# EAGLE schematic frankenbadge (EAGLE 9.4.1)

## Sheet 1 of 2: Main Sheet including: - PSU - RTC - MCU - Nixie tubes - Nixie driver - Nixie multiplexing
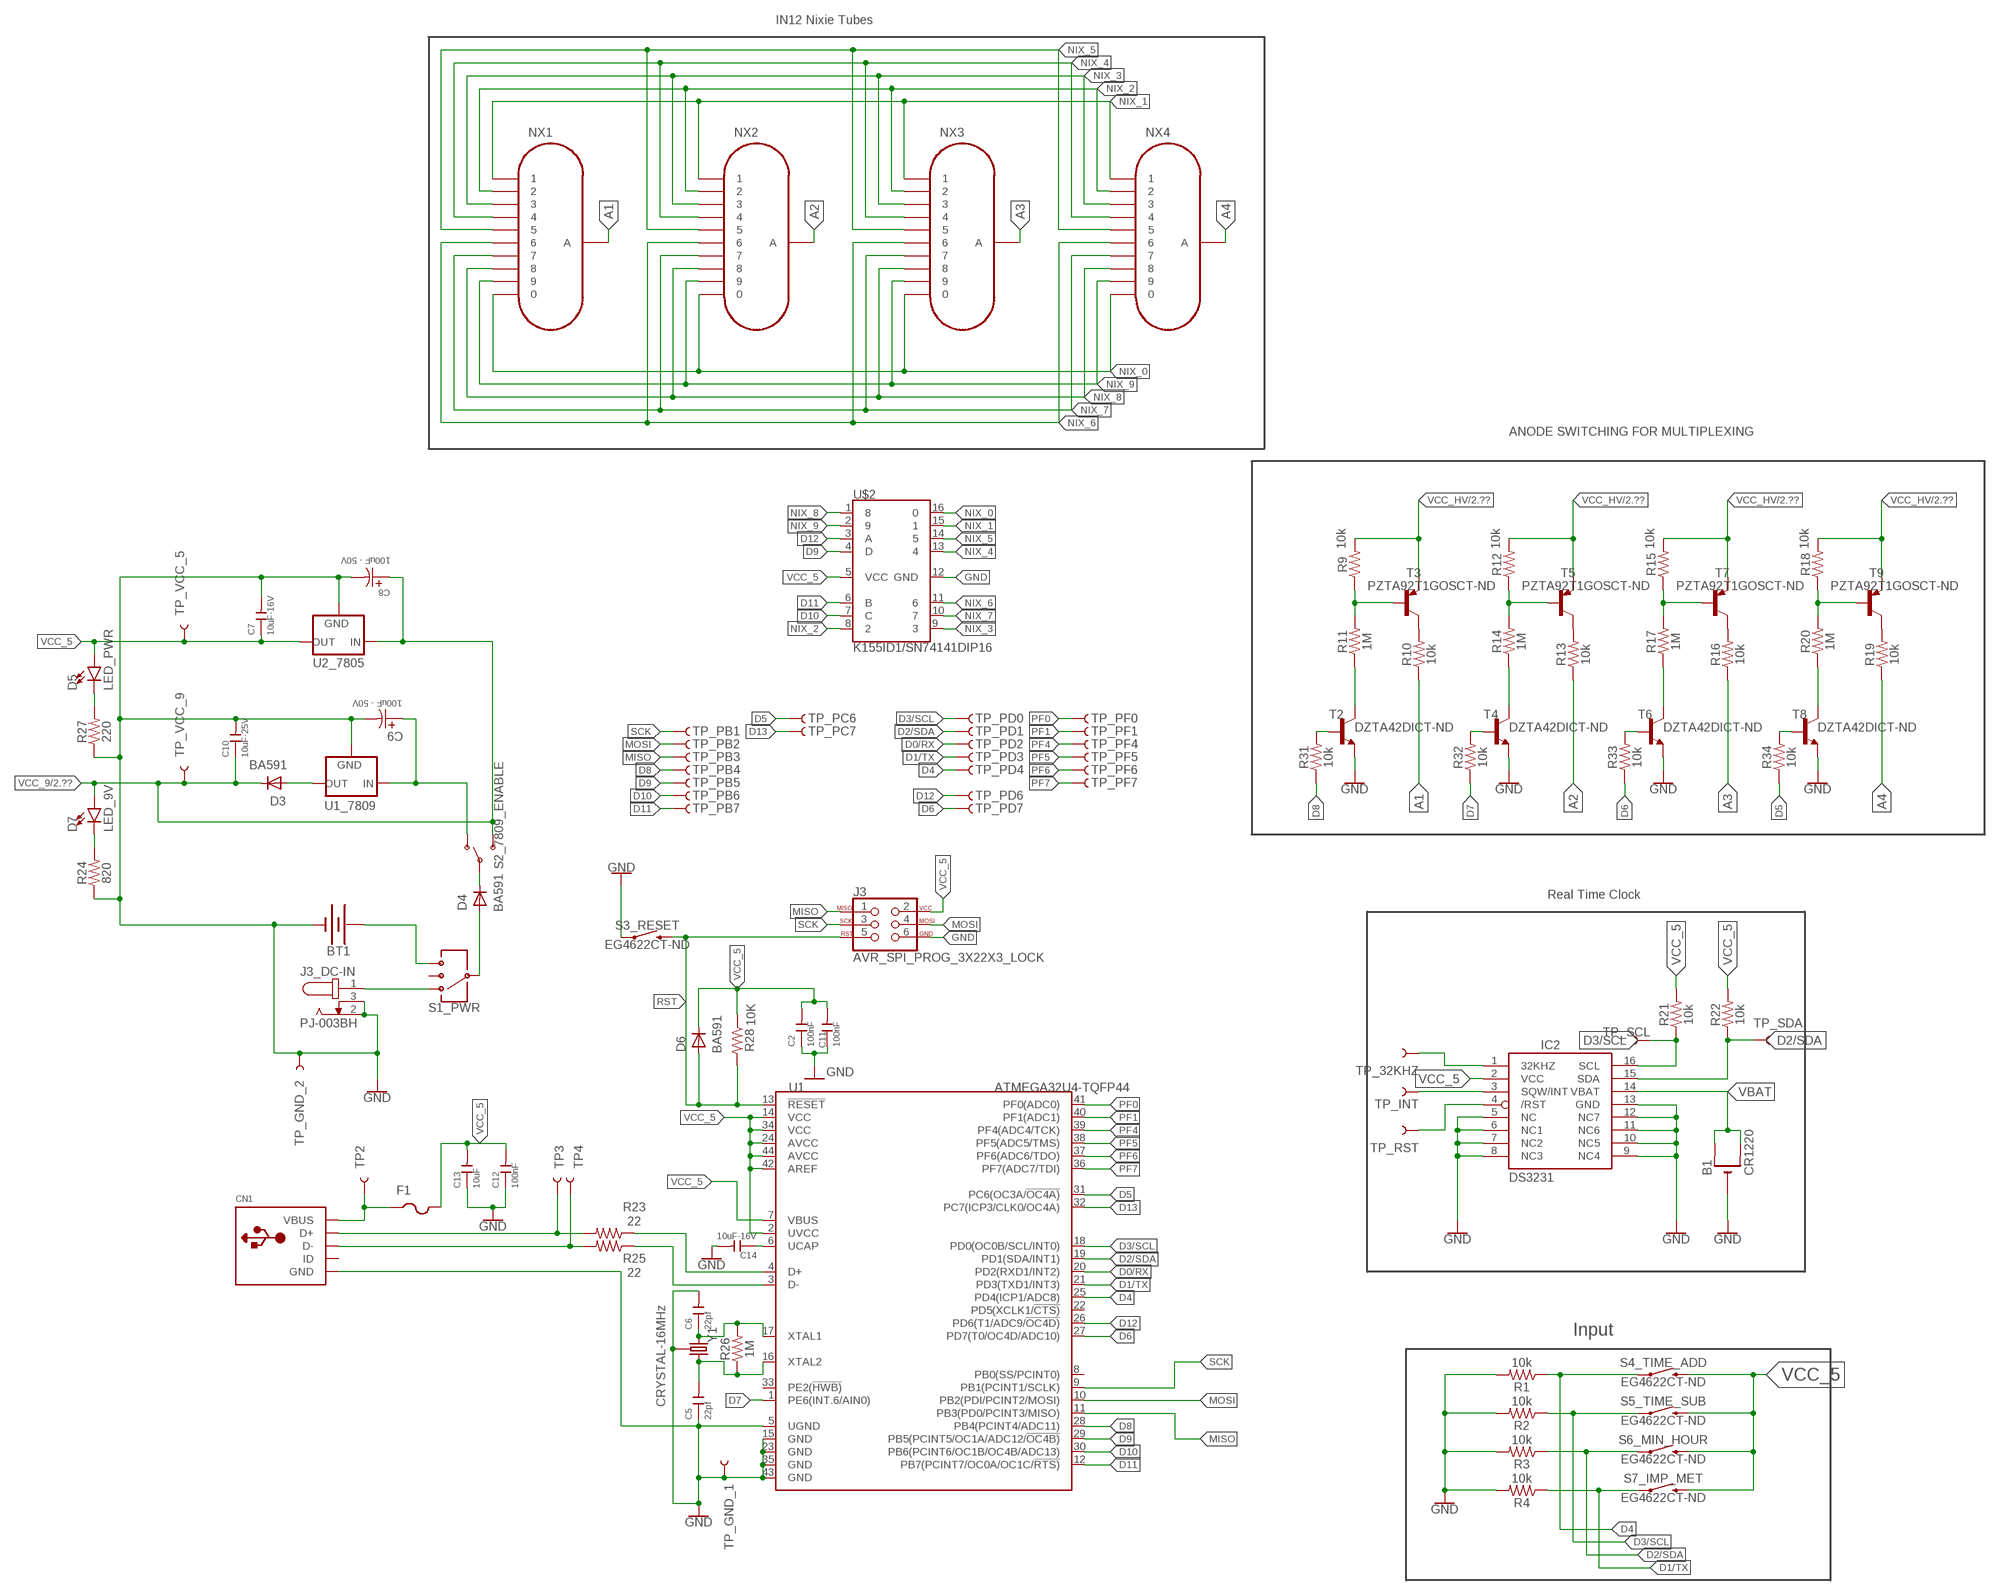
[diagram p0: schematic, sheet 1]

### Parts
B1  CR1220  CR1220SMT  [CR1220-SMD]
BT1  BATTERY-9V  [BATTCON_9V]
C2  100nF  CERAMIC-1UF-25V-10%-X7R(0805)  [C0805]
C5  22pf  CERAMIC-22PF-50V-5%-NPO(0402)  [C0402]
C6  22pf  CERAMIC-22PF-50V-5%-NPO(0402)  [C0402]
C7  10uF-16V  CERAMIC-1UF-25V-10%-X7R(0805)  [C0805]
C8  100uF - 50V  UWT1H101MNL1GSPCAP_8X10-ELECT-M  [PCAP_8X10-ELECT-M]
C9  100uF - 50V  UWT1H101MNL1GSPCAP_8X10-ELECT-M  [PCAP_8X10-ELECT-M]
C10  10uF-25V  CERAMIC-10UF-25V-10%-X5R(1206)  [C1206]
C11  100nF  CERAMIC-1UF-25V-10%-X7R(0805)  [C0805]
C12  100nF  CERAMIC-22PF-50V-5%-NPO(0402)  [C0402]
C13  10uF  CERAMIC-22PF-50V-5%-NPO(0402)  [C0402]
C14  10uF-16V  CERAMIC-1UF-25V-10%-X7R(0805)  [C0805]
CN1  USBMINIB  [USB-MINIB]
D3  BA591  [SOD323(F)]
D4  BA591  [SOD323(F)]
D5  LED_PWR  LED-BLUE0603  [LED-0603]
D6  BA591  [SOD323(F)]
D7  LED_9V  LED-GREEN0603  [LED-0603]
F1  PTCFUSE-1812  [1812]
IC2  DS3231/SO  [SO16W]
J3  AVR_SPI_PROG_3X22X3_LOCK  [2X3_LOCK]
J3_DC-IN  PJ-003BH  [CUI_PJ-003BH]
NX1  IN-12A  [IN-12]
NX2  IN-12A  [IN-12]
NX3  IN-12A  [IN-12]
NX4  IN-12A  [IN-12]
R1  10k  10KOHM-0603-1/10W-1%  [0603]
R2  10k  10KOHM-0603-1/10W-1%  [0603]
R3  10k  10KOHM-0603-1/10W-1%  [0603]
R4  10k  10KOHM-0603-1/10W-1%  [0603]
R9  10k  10KOHM-0603-1/10W-1%  [0603]
R10  10k  10KOHM-0603-1/10W-1%  [0603]
R11  1M  1MOHM-0603-1/4W-5%  [0603]
R12  10k  10KOHM-0603-1/10W-1%  [0603]
R13  10k  10KOHM-0603-1/10W-1%  [0603]
R14  1M  1MOHM-0603-1/4W-5%  [0603]
R15  10k  10KOHM-0603-1/10W-1%  [0603]
R16  10k  10KOHM-0603-1/10W-1%  [0603]
R17  1M  1MOHM-0603-1/4W-5%  [0603]
R18  10k  10KOHM-0603-1/10W-1%  [0603]
R19  10k  10KOHM-0603-1/10W-1%  [0603]
R20  1M  1MOHM-0603-1/4W-5%  [0603]
R21  10k  10KOHM-0603-1/10W-1%  [0603]
R22  10k  10KOHM-0603-1/10W-1%  [0603]
R23  22  220OHM-0603-1/10W-1%  [0603]
R24  820  220OHM-0603-1/10W-1%  [0603]
R25  22  220OHM-0603-1/10W-1%  [0603]
R26  1M  220OHM-0603-1/10W-1%  [0603]
R27  220  220OHM-0603-1/10W-1%  [0603]
R28  10K  220OHM-0603-1/10W-1%  [0603]
R31  10k  10KOHM-0603-1/10W-1%  [0603]
R32  10k  10KOHM-0603-1/10W-1%  [0603]
R33  10k  10KOHM-0603-1/10W-1%  [0603]
R34  10k  10KOHM-0603-1/10W-1%  [0603]
S1_PWR  SWITCH-SP3T-SMD  [SWITCH_SP3T_SMD]
S2_7809_ENABLE  SWITCH-SPDT-SMD-RIGHT-ANGLE  [SWITCH_SPST_SMD_A]
S3_RESET  EG4622CT-ND  MOMENTARY-SWITCH-SPST-SMD-4.5MM  [TACTILE_SWITCH_SMD_4.5MM]
S4_TIME_ADD  EG4622CT-ND  MOMENTARY-SWITCH-SPST-SMD-4.5MM  [TACTILE_SWITCH_SMD_4.5MM]
S5_TIME_SUB  EG4622CT-ND  MOMENTARY-SWITCH-SPST-SMD-4.5MM  [TACTILE_SWITCH_SMD_4.5MM]
S6_MIN_HOUR  EG4622CT-ND  MOMENTARY-SWITCH-SPST-SMD-4.5MM  [TACTILE_SWITCH_SMD_4.5MM]
S7_IMP_MET  EG4622CT-ND  MOMENTARY-SWITCH-SPST-SMD-4.5MM  [TACTILE_SWITCH_SMD_4.5MM]
T2  DZTA42DICT-ND  PBSS4360Z  [SOT223]
T3  PZTA92T1GOSCT-ND  PBSS5360Z  [SOT223]
T4  DZTA42DICT-ND  PBSS4360Z  [SOT223]
T5  PZTA92T1GOSCT-ND  PBSS5360Z  [SOT223]
T6  DZTA42DICT-ND  PBSS4360Z  [SOT223]
T7  PZTA92T1GOSCT-ND  PBSS5360Z  [SOT223]
T8  DZTA42DICT-ND  PBSS4360Z  [SOT223]
T9  PZTA92T1GOSCT-ND  PBSS5360Z  [SOT223]
TP2  TEST-POINT3  [PAD.03X.03]
TP3  TEST-POINT3  [PAD.03X.03]
TP4  TEST-POINT3  [PAD.03X.03]
TP_32KHZ  TEST-POINT3  [PAD.03X.03]
TP_GND_1  TEST-POINT3  [PAD.03X.03]
TP_GND_2  TEST-POINT3  [PAD.03X.03]
TP_INT  TEST-POINT3  [PAD.03X.03]
TP_PB1  TEST-POINT3  [PAD.03X.03]
TP_PB2  TEST-POINT3  [PAD.03X.03]
TP_PB3  TEST-POINT3  [PAD.03X.03]
TP_PB4  TEST-POINT3  [PAD.03X.03]
TP_PB5  TEST-POINT3  [PAD.03X.03]
TP_PB6  TEST-POINT3  [PAD.03X.03]
TP_PB7  TEST-POINT3  [PAD.03X.03]
TP_PC6  TEST-POINT3  [PAD.03X.03]
TP_PC7  TEST-POINT3  [PAD.03X.03]
TP_PD0  TEST-POINT3  [PAD.03X.03]
TP_PD1  TEST-POINT3  [PAD.03X.03]
TP_PD2  TEST-POINT3  [PAD.03X.03]
TP_PD3  TEST-POINT3  [PAD.03X.03]
TP_PD4  TEST-POINT3  [PAD.03X.03]
TP_PD6  TEST-POINT3  [PAD.03X.03]
TP_PD7  TEST-POINT3  [PAD.03X.03]
TP_PF0  TEST-POINT3  [PAD.03X.03]
TP_PF1  TEST-POINT3  [PAD.03X.03]
TP_PF4  TEST-POINT3  [PAD.03X.03]
TP_PF5  TEST-POINT3  [PAD.03X.03]
TP_PF6  TEST-POINT3  [PAD.03X.03]
TP_PF7  TEST-POINT3  [PAD.03X.03]
TP_RST  TEST-POINT3  [PAD.03X.03]
TP_SCL  TEST-POINT3  [PAD.03X.03]
TP_SDA  TEST-POINT3  [PAD.03X.03]
TP_VCC_5  TEST-POINT3  [PAD.03X.03]
TP_VCC_9  TEST-POINT3  [PAD.03X.03]
U1  ATMEGA32U4-TQFP44  MCU-ATMEGA32U4-AU(TQFP44)  [TQFP44-0.8-9.6X9.6MM]
U1_7809  +12v  V_REG_78XX7812  [TO-252]
U2_7805  +12v  V_REG_78XX7812  [TO-252]
U$2  K155ID1/SN74141DIP16  [DIP762W53P254L1969H508Q16B]
Y1  CRYSTAL-16MHz  CRYSTAL-26MHZSMD-3.2X2.5  [CRYSTAL-SMD-3.2X2.5MM]

### Nets
32KHZ: IC2.1(32KHZ) TP_32KHZ.P$1
A1: NX1.A R10.1
A2: NX2.A R13.1
A3: NX3.A R16.1
A4: NX4.A R19.1
D0/RX: TP_PD2.P$1 U1.20(PD2(RXD1/INT2))
D1/TX: R4.1 S7_IMP_MET.2 S7_IMP_MET.3 TP_PD3.P$1 U1.21(PD3(TXD1/INT3))
D2/SDA: IC2.15(SDA) R3.1 R22.1 S6_MIN_HOUR.2 S6_MIN_HOUR.3 TP_PD1.P$1 TP_SDA.P$1 U1.19(PD1(SDA/INT1))
D3/SCL: IC2.16(SCL) R2.1 R21.1 S5_TIME_SUB.2 S5_TIME_SUB.3 TP_PD0.P$1 TP_SCL.P$1 U1.18(PD0(OC0B/SCL/INT0))
D4: R1.1 S4_TIME_ADD.2 S4_TIME_ADD.3 TP_PD4.P$1 U1.25(PD4(ICP1/ADC8))
D5: R34.1 TP_PC6.P$1 U1.31(PC6(OC3A/!OC4A))
D6: R33.1 TP_PD7.P$1 U1.27(PD7(T0/OC4D/ADC10))
D7: R32.1 U1.1(PE6(INT.6/AIN0))
D8: R31.1 TP_PB4.P$1 U1.28(PB4(PCINT4/ADC11))
D9: TP_PB5.P$1 U1.29(PB5(PCINT5/OC1A/ADC12/!OC4B)) U$2.4(D)
D10: TP_PB6.P$1 U1.30(PB6(PCINT6/OC1B/OC4B/ADC13)) U$2.7(C)
D11: TP_PB7.P$1 U1.12(PB7(PCINT7/OC0A/OC1C/!RTS)) U$2.6(B)
D12: TP_PD6.P$1 U1.26(PD6(T1/ADC9/!OC4D)) U$2.3(A)
D13: TP_PC7.P$1 U1.32(PC7(ICP3/CLK0/OC4A))
DS_RST: IC2.4(/RST) TP_RST.P$1
GND: B1.- BT1.- C2.1 C5.1 C6.2 C7.2 C8.2 C9.2 C10.2 C11.1 C12.1 C13.1 C14.2 CN1.GND IC2.5(NC) IC2.6(NC1) IC2.7(NC2) IC2.8(NC3) IC2.9(NC4) IC2.10(NC5) IC2.11(NC6) IC2.12(NC7) IC2.13(GND) J3.6 J3_DC-IN.2 J3_DC-IN.3 R1.2 R2.2 R3.2 R4.2 R24.1 R27.1 S3_RESET.2 S3_RESET.3 T2.3(E) T4.3(E) T6.3(E) T8.3(E) TP_GND_1.P$1 TP_GND_2.P$1 U1.5(UGND) U1.15(GND) U1.23(GND) U1.35(GND) U1.43(GND) U1_7809.3(GND) U2_7805.3(GND) U$2.12(GND) Y1.2 Y1.4 ; also sheet 2
INT: IC2.3(SQW/INT) TP_INT.P$1
MISO: J3.1 TP_PB3.P$1 U1.11(PB3(PD0/PCINT3/MISO))
MOSI: J3.4 TP_PB2.P$1 U1.10(PB2(PDI/PCINT2/MOSI))
N$1: R31.2 T2.1(B)
N$2: R32.2 T4.1(B)
N$3: R33.2 T6.1(B)
N$4: R34.2 T8.1(B)
N$6: R10.2 T3.2(C) T3.4(C)
N$11: C14.1 U1.6(UCAP)
N$14: R9.1 R11.2 T3.1(B)
N$15: R11.1 T2.2(C)
N$16: R13.2 T5.2(C) T5.4(C)
N$17: R12.1 R14.2 T5.1(B)
N$18: R14.1 T4.2(C)
N$19: R16.2 T7.2(C) T7.4(C)
N$20: R15.1 R17.2 T7.1(B)
N$21: R17.1 T6.2(C)
N$22: R19.2 T9.2(C) T9.4(C)
N$23: R18.1 R20.2 T9.1(B)
N$24: R20.1 T8.2(C)
N$25: BT1.+ S1_PWR.4
N$26: J3_DC-IN.1 S1_PWR.1
N$27: D4.2(A) S1_PWR.3
N$28: D4.1(K) S2_7809_ENABLE.2(P)
N$29: C9.1 S2_7809_ENABLE.1(O) U1_7809.1(IN)
N$30: D5.C R27.2
N$31: D3.2(A) U1_7809.2(OUT)
N$32: D7.C R24.2
N$33: C6.1 R26.2 U1.17(XTAL1) Y1.1
N$36: R23.1 U1.4(D+)
N$37: R25.1 U1.3(D-)
N$40: C5.2 R26.1 U1.16(XTAL2) Y1.3
NIX_0: NX1.0 NX2.0 NX3.0 NX4.0 U$2.16
NIX_1: NX1.1 NX2.1 NX3.1 NX4.1 U$2.15
NIX_2: NX1.2 NX2.2 NX3.2 NX4.2 U$2.8
NIX_3: NX1.3 NX2.3 NX3.3 NX4.3 U$2.9
NIX_4: NX1.4 NX2.4 NX3.4 NX4.4 U$2.13
NIX_5: NX1.5 NX2.5 NX3.5 NX4.5 U$2.14
NIX_6: NX1.6 NX2.6 NX3.6 NX4.6 U$2.11
NIX_7: NX1.7 NX2.7 NX3.7 NX4.7 U$2.10
NIX_8: NX1.8 NX2.8 NX3.8 NX4.8 U$2.1
NIX_9: NX1.9 NX2.9 NX3.9 NX4.9 U$2.2
PF0: TP_PF0.P$1 U1.41(PF0(ADC0))
PF1: TP_PF1.P$1 U1.40(PF1(ADC1))
PF4: TP_PF4.P$1 U1.39(PF4(ADC4/TCK))
PF5: TP_PF5.P$1 U1.38(PF5(ADC5/TMS))
PF6: TP_PF6.P$1 U1.37(PF6(ADC6/TDO))
PF7: TP_PF7.P$1 U1.36(PF7(ADC7/TDI))
RST: D6.2(A) J3.5 R28.2 S3_RESET.1 S3_RESET.4 U1.13(!RESET)
SCK: J3.3 TP_PB1.P$1 U1.9(PB1(PCINT1/SCLK))
USB_D+: CN1.D+ R23.2 TP3.P$1
USB_D-: CN1.D- R25.2 TP4.P$1
VBAT: B1.+$1(+) B1.+$2(+1) IC2.14(VBAT)
VBUS: CN1.VBUS F1.1 TP2.P$1
VCC_5: C2.2 C7.1 C11.2 C12.2 C13.2 D5.A D6.1(K) F1.2 IC2.2(VCC) J3.2 R21.2 R22.2 R28.1 S4_TIME_ADD.1 S4_TIME_ADD.4 S5_TIME_SUB.1 S5_TIME_SUB.4 S6_MIN_HOUR.1 S6_MIN_HOUR.4 S7_IMP_MET.1 S7_IMP_MET.4 TP_VCC_5.P$1 U1.2(UVCC) U1.7(VBUS) U1.14(VCC) U1.24(AVCC) U1.34(VCC) U1.42(AREF) U1.44(AVCC) U2_7805.2(OUT) U$2.5(VCC)
VCC_9: C8.1 C10.1 D3.1(K) D7.A S2_7809_ENABLE.3(S) TP_VCC_9.P$1 U2_7805.1(IN) ; also sheet 2
VCC_HV: R9.2 R12.2 R15.2 R18.2 T3.3(E) T5.3(E) T7.3(E) T9.3(E) ; also sheet 2
Unconnected: CN1.ID S1_PWR.2 U1.8(PB0(SS/PCINT0)) U1.22(PD5(XCLK1/!CTS)) U1.33(PE2(!HWB))

### Notes on the sheet
- IN12 Nixie Tubes
- ANODE SWITCHING FOR MULTIPLEXING
- Real Time Clock
- Input

## Sheet 2 of 2
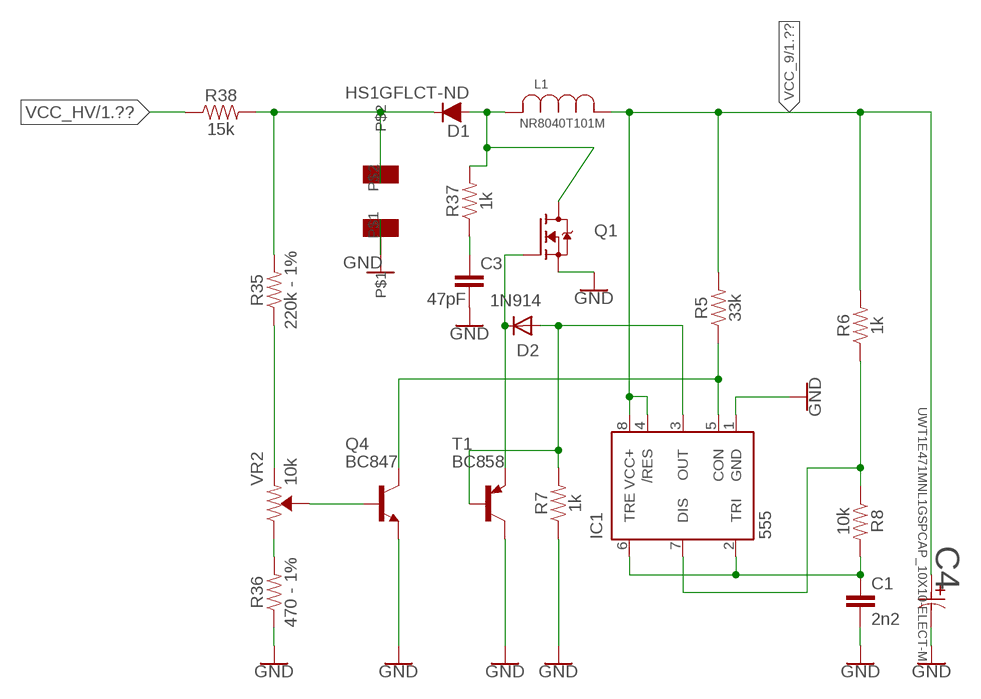
[diagram p1: schematic, sheet 2]

### Parts
C1  2n2  10NF-0603-50V-10%  [0603]
C3  47pF  10NF-0603-50V-10%  [0603]
C4  UWT1E471MNL1GSPCAP_10X10-ELECT-M  [PCAP_10X10-ELECT-M]
D1  HS1GFLCT-ND  D-FILL-SOD123  [SOD123]
D2  1N914  BA591  [SOD323(F)]
IC1  555  555D  [SO08]
L1  NR8040T101M  [IND_TAIYO_NR8040]
Q1  IRF740  TO220  [TO220_NO_HOLE]
Q4  BC847  BCX19  [SOT23]
R5  33k  20OHM-0603-1/10W-1%  [0603]
R6  1k  20OHM-0603-1/10W-1%  [0603]
R7  1k  20OHM-0603-1/10W-1%  [0603]
R8  10k  20OHM-0603-1/10W-1%  [0603]
R35  220k - 1%  20OHM-0603-1/10W-1%  [0603]
R36  470 - 1%  20OHM-0603-1/10W-1%  [0603]
R37  1k  20OHM-0603-1/10W-1%  [0603]
R38  15k  20OHM-0603-1/10W-1%  [0603]
T1  BC858  BCX17  [SOT23]
U$7  SMD_6054  [SMD_6054]
VR2  10k  TRIMPOT-SMD-3MM-OPEN-1/10W-25%  [TRIMPOT-SMD-TC33X]

### Nets
GND: C1.2 C3.2 C4.2 IC1.1(GND) Q1.3(S) Q4.2(E) R7.1 R36.1 T1.3(C) U$7.P$1 ; also sheet 1
N$5: IC1.7(DIS) R6.1 R8.1
N$7: IC1.5(CON) Q4.3(C) R5.1
N$8: D2.2(A) IC1.3(OUT) R7.2 T1.1(B)
N$9: C1.1 IC1.2(TRI) IC1.6(TRE) R8.2
N$10: D1.1(C) R35.2 R38.2 U$7.P$2
N$12: R35.1 VR2.3(CCW)
N$13: Q4.1(B) VR2.2(WIPER)
N$39: R36.2 VR2.1(CW)
N$41: C3.1 R37.1
N$42: D1.2(A) L1.2 Q1.2(D) R37.2
N$43: D2.1(K) Q1.1(G) T1.2(E)
VCC_9: C4.1 IC1.4(/RES) IC1.8(VCC+) L1.1 R5.2 R6.2 ; also sheet 1
VCC_HV: R38.1 ; also sheet 1

## Library data of the parts
B1 = adafruit:CR1220: CR1216/CR1220/CR1225 12mm 3V lithium coin cell Great for battery packup. Both SMT and THM holders. Note the THM package has the ground pads on both sides of the PCB so that the masks are the same - this reduces the cost
BT1 = SparkFun-Batteries:BATTERY: Battery - Single Cell A variety of battery chemistries, sizes, and footprints. Device List: 20MM_PTH - Coin Cell Battery Holder - 20mm (PTH) <https://www.sparkfun.com/products/783> 6.8MM_PTH - Coin Cell Battery Holder - 6.8MM(SMD) <https://www.digikey.com/product-detail/en/seiko-instruments/MS621FE-FL11E/728-1057-ND/1889208?WT.srch=1&gclid=CNOQ5a6LzdQCFZS2wAodXCkE0g> 12MM_SMD - Coin Cell Battery Holder - 12mm (SMD) <https://www.sparkfun.com/products/10592> 12MM_PTH - Coin Cell Battery Holder - 12mm (PTH) <https://www.sparkfun.com/products/7948> 20MM_SMD - 20mm Coin Cell Battery Holder (SMD) (2 legs) Used on the Big Time Watch Kit <https://www.sparkfun.com/products/11734> 20MM_SMD_4LEGS - Coin Cell Battery Holder - 20mm (SMD) <https://www.sparkfun.com/products/11892> 20MM_SMD_4LEGS_OVERPASTE - Coin Cell Battery Holder - 20mm (SMD) <https://www.sparkfun.com/products/11892> (Over-paste on the legs) 24.5MM_PTH - Coin Cell Battery Holder - 24.5mm (PTH) <https://www.sparkfun.com/products/8863> 9V - 9V Battery Holder - PC Mount Used on the SparkFun SparkPunk Sound Kit <https://www.sparkfun.com/products/11177> and SparkFun SparkPunk Sequencer Kit <https://www.sparkfun.com/products/12707> 18650 - Battery Holder - 18650 (PTH) <https://www.sparkfun.com/products/13113> AA - Battery Holder - 1xAA (PTH) <https://www.sparkfun.com/products/7949> AAA - Battery Holder - 1xAAA (PTH) <https://www.sparkfun.com/products/12718> AA_KIT - Battery Holder - 1xAA (PTH) <https://www.sparkfun.com/products/7949> Special kit package - pads only have exposed copper on one side of the board. AAA_KIT - Battery Holder - 1xAAA (PTH) <https://www.sparkfun.com/products/12718> Special kit package - pads only have exposed copper on one side of the board.; PROD_ID: BATT-10855
C1 C3 = SparkFun-Capacitors:10NF: 0.01uF/10nF/10,000pF ceramic capacitors A capacitor is a passive two-terminal electrical component used to store electrical energy temporarily in an electric field. CAP-09321; PROD_ID: CAP-00867; VALUE: 10nF
C2 C7 C11 C14 = OPL_Capacitor:CERAMIC-1UF-25V-10%-X7R(0805): 302010179; MPN: CC0805KKX7R8BB105; VALUE: 1uf
C4 = 493-2194-1-ND:UWT1E471MNL1GS; MANUFACTURER_PART_NUMBER: UWT1E471MNL1GS; VENDOR: Nichicon
C5 C6 = OPL_Capacitor:CERAMIC-22PF-50V-5%-NPO(0402): 302010018; MPN: CC0402JRNPO9BN220
C8 C9 = 493-2226-1-ND:UWT1H101MNL1GS; MANUFACTURER_PART_NUMBER: UWT1H101MNL1GS; VENDOR: Nichicon
C10 = OPL_Capacitor:CERAMIC-10UF-25V-10%-X5R(1206): 302010181; MPN: CC1206KKX5R8BB106; VALUE: 10uf
C12 C13 = OPL_Capacitor:CERAMIC-22PF-50V-5%-NPO(0402): 302010018; MPN: CC0402JRNPO9BN220; VALUE: 22pf
CN1 = adafruit:USB: USB Connectors USBMINIB - Surface Mount Female Mini-B USB Connector 4UConnector: 06564 By microbuilder.eu Thru-hole RA Female Mini-B USB Connector 4UConnector: 18732 By ladyada.net
D1 = semicon-smd-ipc:D-FILL-: DIODE filled
D2 = NXP_60_26022015:BA591: Band-switching diode The BA591 is a planar, high performance band-switching diode in the very small SOD323 (SC-76) SMD plastic package. AAL Eindhoven MK; VALUE_: 1N914
D3 D4 D6 = NXP_60_26022015:BA591: Band-switching diode The BA591 is a planar, high performance band-switching diode in the very small SOD323 (SC-76) SMD plastic package. AAL Eindhoven MK
D5 = SparkFun-LED:LED-BLUE: Blue SMD LED Used in manufacturing of various products at SparkFun Packages: 0603 - SMD 0603 package [Product Link] <http://www.digikey.com/product-detail/en/SMLE12BC7TT86/511-1589-2-ND/1641808> 1206 - SMD1206 package [Product Link] <http://www.digikey.com/product-detail/en/lite-on-inc/LTST-C150TBKT/160-1643-1-ND/573584> SparkFun Products: ESP8266 Thing-Dev Board <https://www.sparkfun.com/products/13711> RedBoard <https://www.sparkfun.com/products/12757>; PROD_ID: DIO-08575; VALUE: BLUE
D7 = SparkFun-LED:LED-GREEN: Green SMD LED Used in manufacturing of various products at SparkFun Packages: 0603 - SMD 0603 package [Product Link] <http://www.futureelectronics.com/en/technologies/semiconductors/optoelectronics/leds/Pages/9894312-LTST-C190GKT.aspx?CrossPart=HSMG-C190&IM=0> LilyPad 1206 - SMD1206 LilyPad package [Product Link] <http://www.futureelectronics.com/en/Technologies/Product.aspx?ProductID=IN150NGHARVATEKCORPORATION2049943&IM=0> 1206 - SMD1206 package [Product Link] <http://www.futureelectronics.com/en/technologies/semiconductors/optoelectronics/leds/Pages/8315665-LTST-C150KGKT.aspx?IM=0> 1206 Bottom Mount -SMD 1206 Bottom Mount [Product Link] <http://www.digikey.com/product-detail/en/lite-on-inc/LTST-C230KGKT/160-1456-1-ND/386854> SparkFun Products: Pro Mini 328 -5V <https://www.sparkfun.com/products/821> RedBoard <https://www.sparkfun.com/products/12757> MP3 Trigger <https://www.sparkfun.com/products/13720> Makey Makey <https://www.sparkfun.com/products/11076>; PROD_ID: DIO-00821; VALUE: GREEN
F1 = adafruit:PTCFUSE: PTC fuses, resettable thermistors
IC1 = SparkFun-IC-Special-Function:555: General purpose bipolar Timer Datasheet <http://www.sparkfun.com/datasheets/Components/General/ne555.pdf> SparkFun Products SparkFun SparkPunk Sequencer Kit <https://www.sparkfun.com/products/12707> (KIT-12707) Storefront Component: 555 Timer <https://www.sparkfun.com/products/9273> (COM-09273) Two parts valid for production: VFP: IC-11930 (M7555 PTH) VFP: IC-09173 (555 PTH) - Preferred; PROD_ID: NA-XXXXX
IC2 = adafruit:DS3231
J3 = SparkFun-Connectors:AVR_SPI_PROG_3X2: AVR ISP 6 Pin This is the reduced ISP connector for AVR programming. Common on Arduino. This footprint will take up less PCB space and can be used with a 10-pin to 6-pin adapter such as SKU: BOB-08508 **Special note about "TEST_POINT" package. The stop mask is on the top side, so if you want your programming test points to be on the bottom of your board, make sure to place this package on the bottom side of the board. This also ensure that the orientation to program from the bottom side will be correct. SparkFun Products: SparkFun ISP Pogo Adapter <https://www.sparkfun.com/products/11591> - NS Tiny AVR Programmer <https://www.sparkfun.com/products/11801> -PTH
J3_DC-IN = PJ-003BH:PJ-003BH: 2.5 mm Center Pin, 5.0 A, Right Angle, Through Hole, Open Frame, Dc Power Jack Connector; MANUFACTURER: CUI INC; STANDARD: Manufacturer recommendations
L1 = drn0psl3d:NR8040T101M; MANUFACTURER_PART_NUMBER: NR8040T101M; VENDOR: TAIYO YUDEN
NX1-NX4 = nixies-us:IN-12A: IN-12A: medium numeric topview nixie tube
Q1 = drn0psl3d:TO220
Q4 = NXP_60_26022015:BCX19: NPN general purpose transistor NPN transistor in a SOT23 plastic package. PNP complement: BCX17. AAL Eindhoven MK
R1-R4 R9 R10 R12 R13 R15 R16 R18 R19 R21 R22 R31-R34 = SparkFun-Resistors:10KOHM: 10kΩ resistor A resistor is a passive two-terminal electrical component that implements electrical resistance as a circuit element. Resistors act to reduce current flow, and, at the same time, act to lower voltage levels within circuits. - Wikipedia; PROD_ID: RES-00824
R5-R8 R35-R38 = SparkFun-Resistors:20OHM: RES-07862; PROD_ID: RES-07862; VALUE: 20
R11 R14 R17 R20 = SparkFun-Resistors:1MOHM: 1MΩ resistor A resistor is a passive two-terminal electrical component that implements electrical resistance as a circuit element. Resistors act to reduce current flow, and, at the same time, act to lower voltage levels within circuits. - Wikipedia; PROD_ID: RES-07868
R23-R26 R28 = SparkFun-Resistors:220OHM: 220Ω resistor A resistor is a passive two-terminal electrical component that implements electrical resistance as a circuit element. Resistors act to reduce current flow, and, at the same time, act to lower voltage levels within circuits. - Wikipedia; PROD_ID: RES-07861; VALUE: 220
R27 = SparkFun-Resistors:220OHM: 220Ω resistor A resistor is a passive two-terminal electrical component that implements electrical resistance as a circuit element. Resistors act to reduce current flow, and, at the same time, act to lower voltage levels within circuits. - Wikipedia; PROD_ID: RES-07861
S1_PWR = SparkFun-Switches:SWITCH-SP3T: Single-Pole, Triple-Throw (SP3T) Switch Single-Pole, Triple-Throw switches SparkFun Products Prototype Part; PROD_ID: SWCH-10805
S2_7809_ENABLE = SparkFun-Switches:SWITCH-SPDT: Single Pole, Double Throw (SPDT) Switch Single-pole, double-throw (SPDT) switch. Variant Overview SMD-AYZ0202 Surface Mount DPDT Switch <https://www.sparkfun.com/products/597> (COM-00597) Used on e.g. LilyPad Arduino USB - ATmega32U4 Board <https://www.sparkfun.com/products/12049> PTH-11.6X4.0MM SPDT Mini Power Switch <https://www.sparkfun.com/products/102> (COM-00102) Used on e.g. SparkFun Simon Says - Through-Hole Soldering Kit <https://www.sparkfun.com/products/10547> (KIT-10547) PTH-11.6X4.0MM-KIT KIT version of SPDT Mini Power Switch - Simplifies soldering by removing tStop of switch pins - only one side can be soldered. PTH-11.6X4.0MM-LOCK LOCK version of SPDT Mini Power Switch - Offset pins hold switch in place for easier soldering. SMD-RIGHT-ANGLE Surface Mount Right Angle Switch <https://www.sparkfun.com/products/10860> (COM-10860) Used on e.g. SparkFun ESP8266 Thing <https://www.sparkfun.com/products/13231>; PROD_ID: SWCH-10651; SF_SKU: COM-10860
S3_RESET S4_TIME_ADD S5_TIME_SUB S6_MIN_HOUR S7_IMP_MET = SparkFun-Switches:MOMENTARY-SWITCH-SPST: Momentary Switch (Pushbutton) - SPST Normally-open (NO) SPST momentary switches (buttons, pushbuttons). Variants PTH-12MM - 12mm square, through-hole Momentary Pushbutton Switch - 12mm Square <https://www.sparkfun.com/products/9190> (COM-09190) PTH-6.0MM, PTH-6.0MM-KIT - 6.0mm square, through-hole Mini Pushbutton Switch <https://www.sparkfun.com/products/97> (COM-00097) KIT package intended for soldering kit's - only one side of pads' copper is exposed. PTH-RIGHT-ANGLE-KIT - Right-angle, through-hole Right Angle Tactile Button <https://www.sparkfun.com/products/10791> - Used on SparkFun BigTime Watch Kit <https://www.sparkfun.com/products/11734> SMD-12MM - 12mm square, surface-mount Tactile Button - SMD (12mm) <https://www.sparkfun.com/products/12993> (COM-12993) Used on SparkFun PicoBoard <https://www.sparkfun.com/products/11888> SMD-4.5MM - 4.5mm Square Trackball Switch Used on SparkFun Blackberry Trackballer Breakout <https://www.sparkfun.com/products/13169> SMD-4.6MMX2.8MM - 4.60mm x 2.80mm, surface mount Used on SparkFun SAMD21 Mini Breakout <https://www.sparkfun.com/products/13664> SMD-5.2MM, SMD-5.2-REDUNDANT - 5.2mm square, surface-mount Mini Pushbutton Switch - SMD <https://www.sparkfun.com/products/8720> (COM-08720) Used on Arduino Pro Mini <https://www.sparkfun.com/products/11114> REDUNDANT package connects both switch circuits together SMD-6.0X3.5MM - 6.0 x 3.5mm, surface mount Momentary Reset Switch SMD <https://www.sparkfun.com/products/8229> (COM-08229) SMD-6.2MM-TALL - 6.2mm square, surface mount Tactile Button - SMD (6mm) <https://www.sparkfun.com/products/12992> Used on SparkFun Digital Sandbox <https://www.sparkfun.com/products/12651> SMD-RIGHT-ANGLE - Right-angle, surface mount Used on SparkFun Block for Intel® Edison - Arduino <https://www.sparkfun.com/products/13036>; PROD_ID: SWCH-09213
T1 = NXP_60_26022015:BCX17: PNP general purpose transistors PNP transistor in a SOT23 plastic package. NPN complement: BCX19. AAL Eindhoven MK
T2 T4 T6 T8 = NXP_60_26022015:PBSS4360Z: 60 V, 3 A NPN low VCEsat (BISS) transistor NPN low VCEsat Breakthrough In Small Signal (BISS) transistor in a medium power SOT223 (SC-73) Surface-Mounted Device (SMD) plastic package. PNP complement: PBSS5360Z. AAL Eindhoven MK
T3 T5 T7 T9 = NXP_60_26022015:PBSS5360Z: 60 V, 3 A PNP low VCEsat (BISS) transistor PNP low VCEsat Breakthrough In Small Signal (BISS) transistor in a medium power SOT223 (SC-73) Surface-Mounted Device (SMD) plastic package. NPN complement: PBSS4360Z. AAL Eindhoven MK
TP2-TP4 TP_32KHZ TP_GND_1 TP_GND_2 TP_INT TP_PB1-TP_PB7 TP_PC6 TP_PC7 TP_PD0 TP_PD1-TP_PD4 TP_PD6 TP_PD7 TP_PF0 TP_PF1 TP_PF4-TP_PF7 TP_RST TP_SCL TP_SDA TP_VCC_5 TP_VCC_9 = SparkFun-Connectors:TEST-POINT: SparkFun Test Points Bare copper test points for troubleshooting or In-Circuit-Testing. These are used by our Production team for verifying production board runs using pogo-pins on test beds. SparkFun Products: SparkFun LSM9DS1 Breakout <https://www.sparkfun.com/products/13284> SparkFun PSOC <https://www.sparkfun.com/products/13714> SparkFun Load Cell Amplifier <https://www.sparkfun.com/products/13879>
U1 = OPL_IC:MCU-ATMEGA32U4-AU(TQFP44): 310010010; MPN: ATMEGA32U4
U1_7809 U2_7805 = SparkFun-IC-Power:V_REG_78XX: Voltage Regulator Standard 78xx regulator. IGO (Input Ground Output). Spark Fun Electronics SKU : COM-00107; PROD_ID: VREG-12370
U$2 = drn0psl3d:K155ID1/SN74141
U$7 = drn0psl3d:SMD_6054: SMD 6054 footprint 0.60 x 0.54 inch 600 x 540 mil 15.24 x 13.716mm
VR2 = SparkFun-Resistors:TRIMPOT: Trimming Potentiometer (Trimpot) Three-terminal potentiometers, with an adjustable wiper and two adjustable resistors. A pot can be used to create a configurable voltage divider, or as a variable resistor. "Trimpots" are a subset of potentiometers, usually intended for "set-and-forget" applications. They're often more delicate than standard potentiometers - rated for fewer turns. Variants PTH-KNOB - PTH Trimpot w/ finger-adjustable knob Trimpot 10K with Knob <https://www.sparkfun.com/products/9806> (COM-09806) Datasheet <http://www.sparkfun.com/datasheets/Components/General/TSR-3386.pdf> SMD-3MM-CLOSED-FRAME - SMD 3mm Square Closed-Frame Trimpot Used on e.g. EasyDriver - Stepper Motor Driver <https://www.sparkfun.com/products/12779> Datasheet <http://www.bitechnologies.com/pdfs/22.pdf> (22AR10KTR) SMD-5MM - SMD 5mm Square Closed-Frame Trimpot Used on e.g. IOIO-OTG - V2.2 <https://www.sparkfun.com/products/13613> Datasheet <http://www.vishay.com/docs/51008/ts53.pdf> (TS53YL502MR10) SMD-3MM-1/10W-25% - 3mm Square Open-Frame Trimpot Used on e.g. SparkFun Shapeoko <https://www.sparkfun.com/products/13899> Datasheet <http://www.bourns.com/docs/Product-Datasheets/TC33.pdf> (TC33X-2-103E); PROD_ID: RES-12428
Y1 = SparkFun-Clocks:CRYSTAL-26MHZ: 26MHz Crystal w/ Ground Pin Digikey Example <http://www.digikey.com/product-detail/en/epson/TSX-3225%2026.0000MF09Z-AC3/SER3627CT-ND/1802878> Frequency: 26MHz Frequency Stability: ±9ppm Frequency Tolerance: ±10ppm Load Capacitance: 9pF SparkFun Products: SparkFun ESP32 Thing <https://www.sparkfun.com/products/13907> SparkFun ESP8266 Thing Dev Board <https://www.sparkfun.com/products/13711>; PROD_ID: XTAL-12454